# EAGLE design goodfetS10 (EAGLE 5.07)
PART_NO: ATS080B
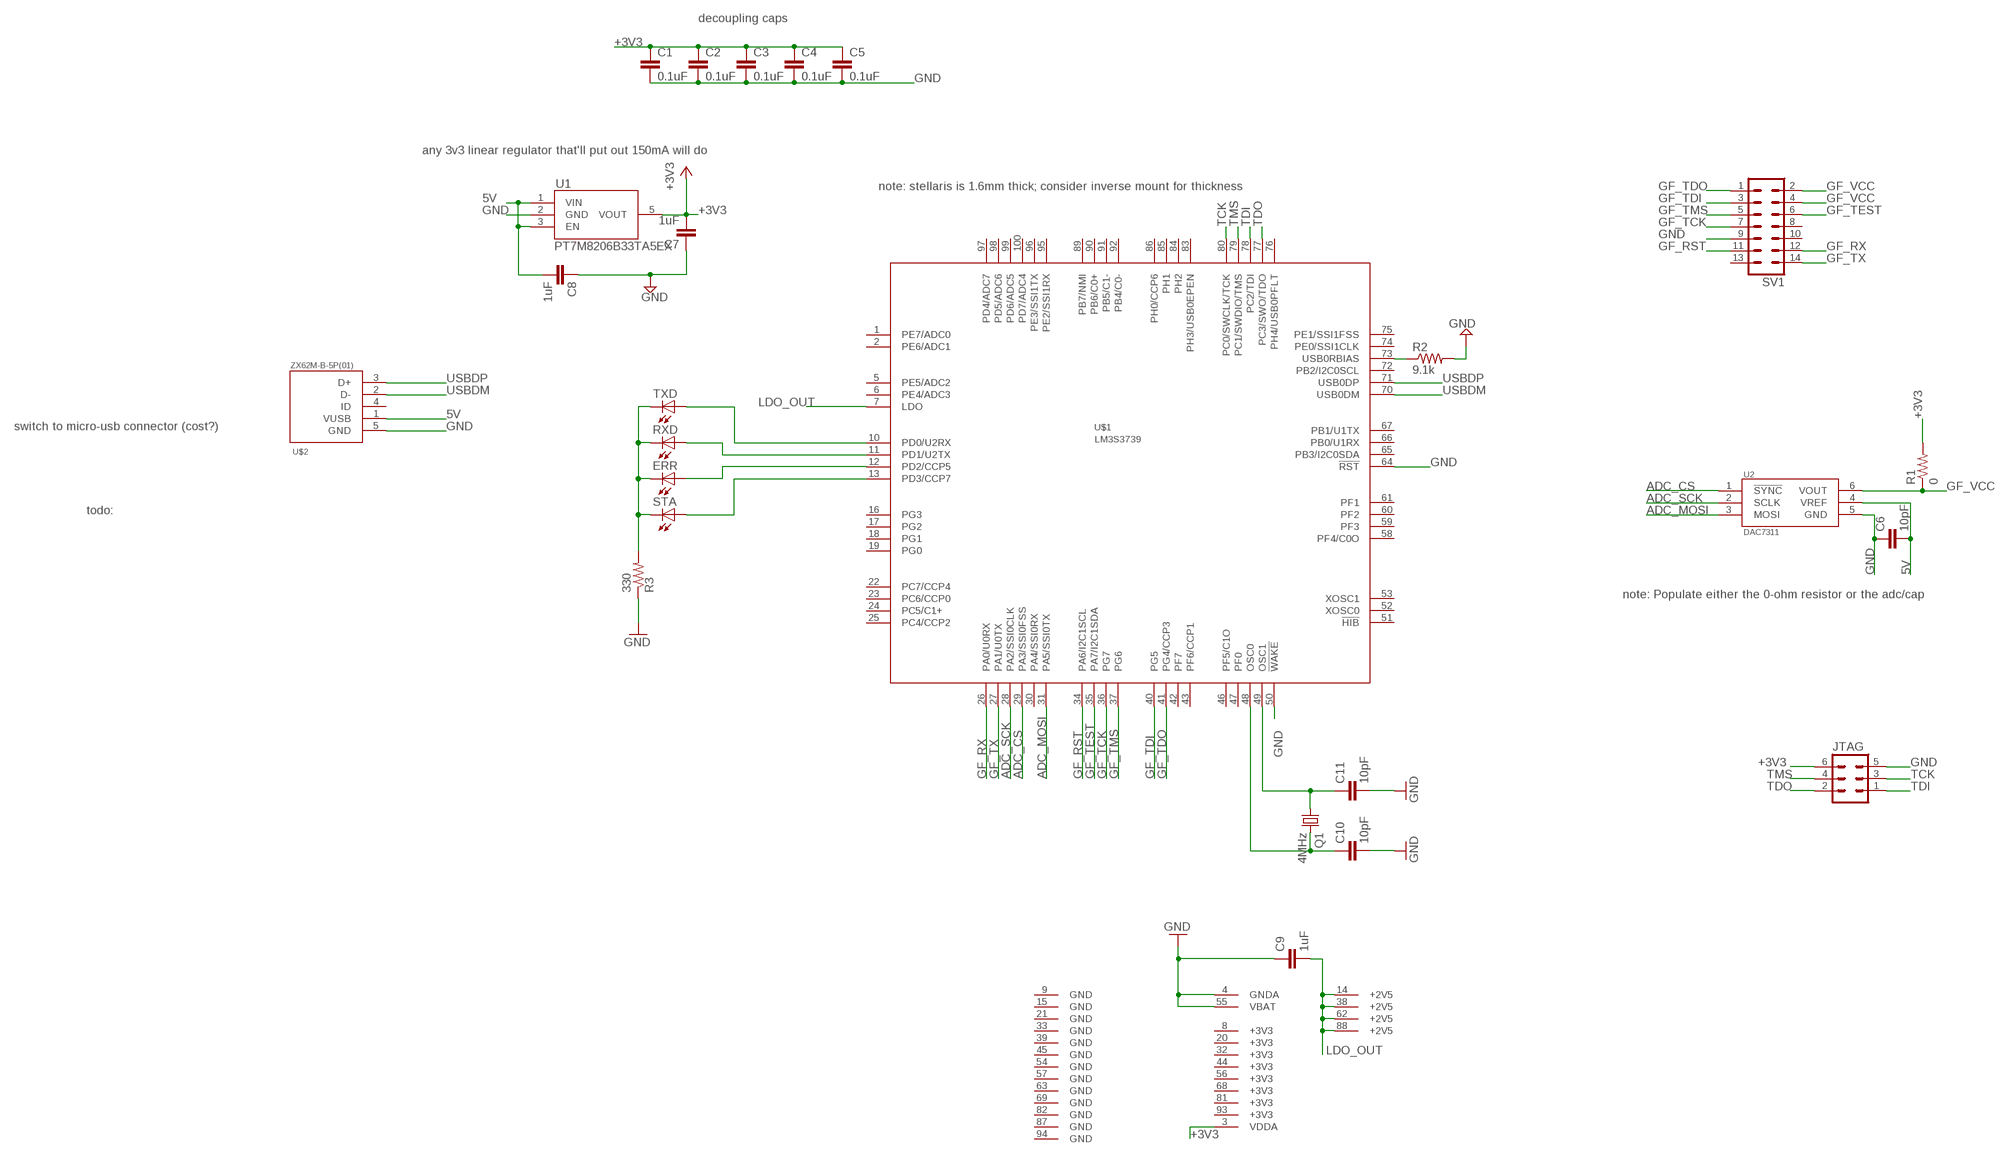
[diagram p0: schematic, sheet 1]

## Parts
C1  0.1uF  C-EUC0603  [C0603]
C2  0.1uF  C-EUC0603  [C0603]
C3  0.1uF  C-EUC0603  [C0603]
C4  0.1uF  C-EUC0603  [C0603]
C5  0.1uF  C-EUC0603  [C0603]
C6  10pF  C-EUC0603  [C0603]
C7  1uF  C-EUC0603  [C0603]
C8  1uF  C-EUC0603  [C0603]
C9  1uF  C-EUC0603  [C0603]
C10  10pF  C-EUC0603  [C0603]
C11  10pF  C-EUC0603  [C0603]
ERR  LEDCHIP-LED0603  [CHIP-LED0603]
JTAG  MA03-2  [MA03-2]
Q1  4MHz  CRYSTALHC49S  [HC49/S]
R1  0  R-US_R0603  [R0603]
R2  9.1k  R-US_R0603  [R0603]
R3  330  R-US_R0603  [R0603]
RXD  LEDCHIP-LED0603  [CHIP-LED0603]
STA  LEDCHIP-LED0603  [CHIP-LED0603]
SV1  MA07-2  [MA07-2]
TXD  LEDCHIP-LED0603  [CHIP-LED0603]
U1  PT7M8206B33TA5EX  [SOT23]
U2  DAC7311  [DCK]
U$1  LM3S3739  [QFP50P1600X1600X160-100N]
U$2  ZX62M-B-5P(01)  [ZX62M-B-5P(01)]

## Nets
5V: C6.2 C8.2 U1.1(VIN) U1.3(EN) U2.4(VREF) U$2.1(VUSB)
+3V3: C1.1 C2.1 C3.1 C4.1 C5.1 C7.2 JTAG.6 R1.2 U1.5(VOUT) U$1.3(VDDA)
ADC_CS: U2.1(!SYNC) U$1.29(PA3/SSI0FSS)
ADC_MOSI: U2.3(MOSI) U$1.31(PA5/SSI0TX)
ADC_SCK: U2.2(SCLK) U$1.28(PA2/SSI0CLK)
GF_RST: SV1.11 U$1.34(PA6/I2C1SCL)
GF_RX: SV1.12 U$1.26(PA0/U0RX)
GF_TCK: SV1.7 U$1.36(PG7)
GF_TDI: SV1.3 U$1.40(PG5)
GF_TDO: SV1.1 U$1.41(PG4/CCP3)
GF_TEST: SV1.6 U$1.35(PA7/I2C1SDA)
GF_TMS: SV1.5 U$1.37(PG6)
GF_TX: SV1.14 U$1.27(PA1/U0TX)
GF_VCC: R1.1 SV1.2 SV1.4 U2.6(VOUT)
GND: C1.2 C2.2 C3.2 C4.2 C5.2 C6.1 C7.1 C8.1 C9.1 C10.2 C11.2 JTAG.5 R2.2 R3.1 SV1.9 U1.2(GND) U2.5(GND) U$1.4(GNDA) U$1.50(!WAKE) U$1.55(VBAT) U$1.64(!RST) U$2.5(GND)
LDO_OUT: C9.2 U$1.7(LDO) U$1.14(+2V5) U$1.38(+2V5) U$1.62(+2V5) U$1.88(+2V5)
N$1: R2.1 U$1.73(USB0RBIAS)
N$2: C10.1 Q1.2 U$1.48(OSC0)
N$3: C11.1 Q1.1 U$1.49(OSC1)
N$4: ERR.C R3.2 RXD.C STA.C TXD.C
N$5: STA.A U$1.13(PD3/CCP7)
N$6: ERR.A U$1.12(PD2/CCP5)
N$7: RXD.A U$1.11(PD1/U2TX)
N$8: TXD.A U$1.10(PD0/U2RX)
TCK: JTAG.3 U$1.80(PC0/SWCLK/TCK)
TDI: JTAG.1 U$1.78(PC2/TDI)
TDO: JTAG.2 U$1.77(PC3/SWO/TDO)
TMS: JTAG.4 U$1.79(PC1/SWDIO/TMS)
USBDM: U$1.70(USB0DM) U$2.2(D-)
USBDP: U$1.71(USB0DP) U$2.3(D+)
Unconnected: SV1.8 SV1.10 SV1.13 U$1.1(PE7/ADC0) U$1.2(PE6/ADC1) U$1.5(PE5/ADC2) U$1.6(PE4/ADC3) U$1.16(PG3) U$1.17(PG2) U$1.18(PG1) U$1.19(PG0) U$1.22(PC7/CCP4) U$1.23(PC6/CCP0) U$1.24(PC5/C1+) U$1.25(PC4/CCP2) U$1.30(PA4/SSI0RX) U$1.42(PF7) U$1.43(PF6/CCP1) U$1.46(PF5/C1O) U$1.47(PF0) U$1.51(!HIB) U$1.52(XOSC0) U$1.53(XOSC1) U$1.58(PF4/C0O) U$1.59(PF3) U$1.60(PF2) U$1.61(PF1) U$1.65(PB3/I2C0SDA) U$1.66(PB0/U1RX) U$1.67(PB1/U1TX) U$1.72(PB2/I2C0SCL) U$1.74(PE0/SSI1CLK) U$1.75(PE1/SSI1FSS) U$1.76(PH4/USB0PFLT) U$1.83(PH3/USB0EPEN) U$1.84(PH2) U$1.85(PH1) U$1.86(PH0/CCP6) U$1.89(PB7/NMI) U$1.90(PB6/C0+) U$1.91(PB5/C1-) U$1.92(PB4/C0-) U$1.95(PE2/SSI1RX) U$1.96(PE3/SSI1TX) U$1.97(PD4/ADC7) U$1.98(PD5/ADC6) U$1.99(PD6/ADC5) U$1.100(PD7/ADC4) U$2.4(ID)

## Notes on the sheet
- decoupling caps
- any 3v3 linear regulator that'll put out 150mA will do
- note: stellaris is 1.6mm thick; consider inverse mount for thickness
- switch to micro-usb connector (cost?)
- todo:
- note: Populate either the 0-ohm resistor or the adc/cap

## Power pins joined to a net without a drawn wire
+3V3: U$1.8(+3V3) U$1.20(+3V3) U$1.32(+3V3) U$1.44(+3V3) U$1.56(+3V3) U$1.68(+3V3) U$1.81(+3V3) U$1.93(+3V3)
GND: U$1.9(GND) U$1.15(GND) U$1.21(GND) U$1.33(GND) U$1.39(GND) U$1.45(GND) U$1.54(GND) U$1.57(GND) U$1.63(GND) U$1.69(GND) U$1.82(GND) U$1.87(GND) U$1.94(GND)

## Library data of the parts
C1-C11 = rcl:C-EU: CAPACITOR, European symbol
ERR RXD STA TXD = led:LED: LED OSRAM: - CHIPLED LG R971, LG N971, LY N971, LG Q971, LY Q971, LO R971, LY R971 LH N974, LH R974 LS Q976, LO Q976, LY Q976 LO Q996 - Hyper CHIPLED LW Q18S LB Q993, LB Q99A, LB R99A - SideLED LS A670, LO A670, LY A670, LG A670, LP A670 LB A673, LV A673, LT A673, LW A673 LH A674 LY A675 LS A676, LA A676, LO A676, LY A676, LW A676 LS A679, LY A679, LG A679 - Hyper Micro SIDELED® LS Y876, LA Y876, LO Y876, LY Y876 LT Y87S - SmartLED LW L88C, LW L88S LB L89C, LB L89S, LG L890 LS L89K, LO L89K, LY L89K LS L896, LA L896, LO L896, LY L896 - TOPLED LS T670, LO T670, LY T670, LG T670, LP T670 LSG T670, LSP T670, LSY T670, LOP T670, LYG T670 LG T671, LOG T671, LSG T671 LB T673, LV T673, LT T673, LW T673 LH T674 LS T676, LA T676, LO T676, LY T676, LB T676, LH T676, LSB T676, LW T676 LB T67C, LV T67C, LT T67C, LS T67K, LO T67K, LY T67K, LW E67C LS E67B, LA E67B, LO E67B, LY E67B, LB E67C, LV E67C, LT E67C LW T67C LS T679, LY T679, LG T679 LS T770, LO T770, LY T770, LG T770, LP T770 LB T773, LV T773, LT T773, LW T773 LH T774 LS E675, LA E675, LY E675, LS T675 LS T776, LA T776, LO T776, LY T776, LB T776 LHGB T686 LT T68C, LB T68C - Hyper Mini TOPLED® LB M676 - Mini TOPLED Santana® LG M470 LS M47K, LO M47K, LY M47K Source: http://www.osram.convergy.de LUXEON: - LUMILED® LXK2-PW12-R00, LXK2-PW12-S00, LXK2-PW14-U00, LXK2-PW14-V00 LXK2-PM12-R00, LXK2-PM12-S00, LXK2-PM14-U00 LXK2-PE12-Q00, LXK2-PE12-R00, LXK2-PE12-S00, LXK2-PE14-T00, LXK2-PE14-U00 LXK2-PB12-K00, LXK2-PB12-L00, LXK2-PB12-M00, LXK2-PB14-N00, LXK2-PB14-P00, LXK2-PB14-Q00 LXK2-PR12-L00, LXK2-PR12-M00, LXK2-PR14-Q00, LXK2-PR14-R00 LXK2-PD12-Q00, LXK2-PD12-R00, LXK2-PD12-S00 LXK2-PH12-R00, LXK2-PH12-S00 LXK2-PL12-P00, LXK2-PL12-Q00, LXK2-PL12-R00 Source: www.luxeon.com KINGBRIGHT: KA-3528ASYC Source: www.kingbright.com
JTAG = con-lstb:MA03-2: PIN HEADER
Q1 = crystal:CRYSTAL: CRYSTAL
R1-R3 = rcl:R-US_: RESISTOR, American symbol
SV1 = random-carp:MA07-2: PIN HEADER
U1 = random-carp:PT7M8206B33TA5EX
U2 = ti-stuff:DAC7311
U$1 = stellaris:LM3S3739
U$2 = random-carp:ZX62M-B-5P(01)

## Board
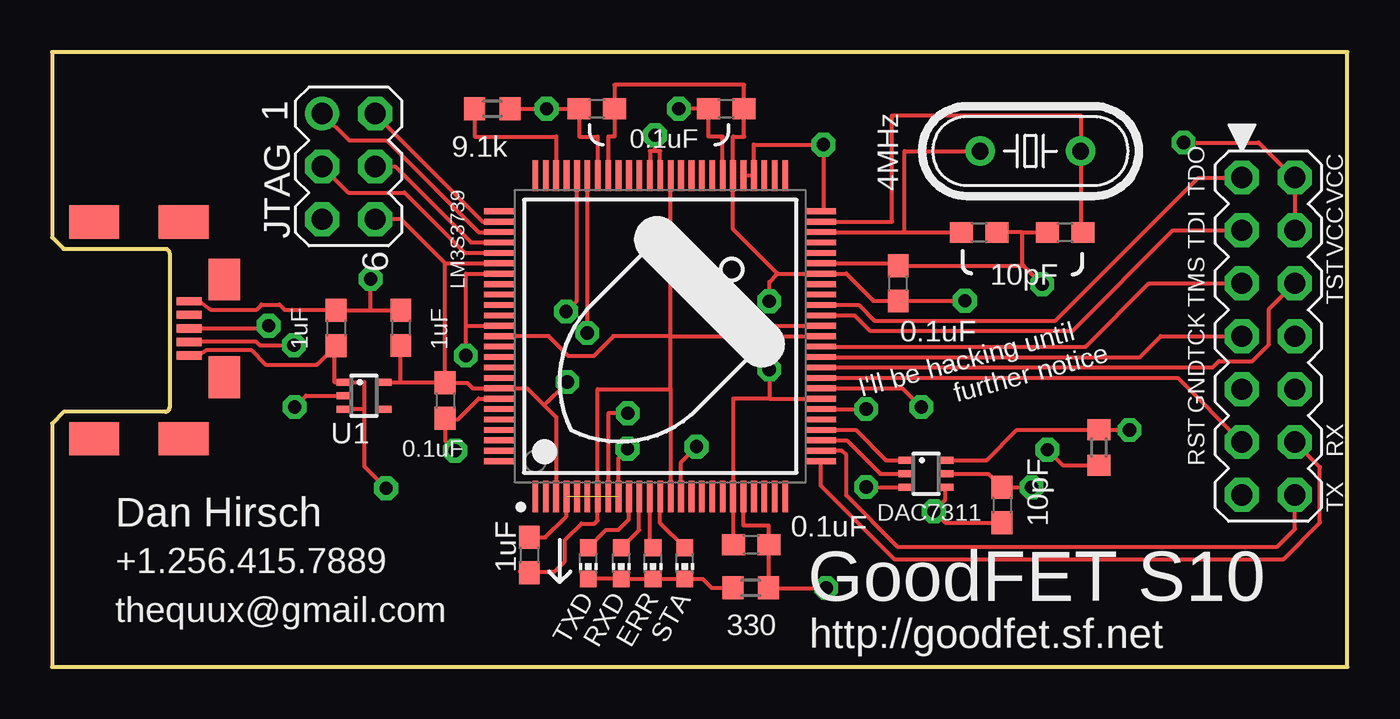
[diagram p1: board, top side]
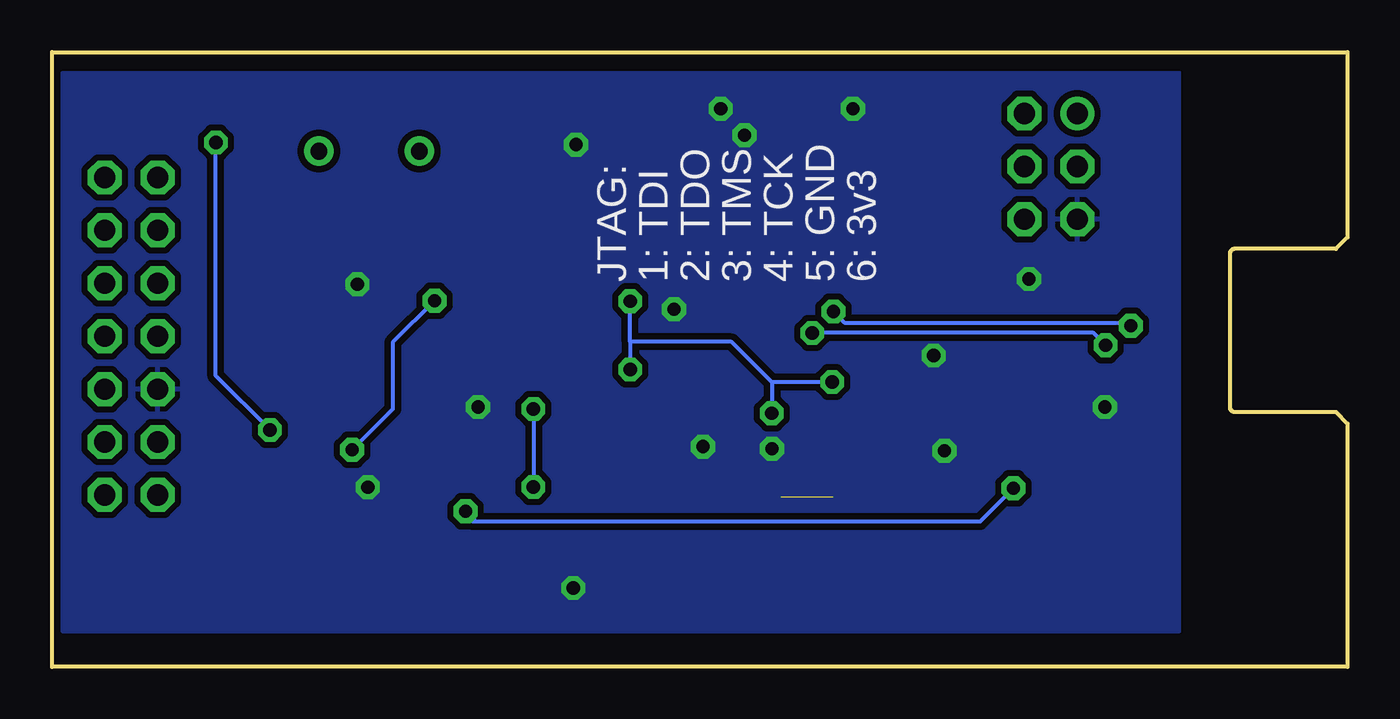
[diagram p2: board, bottom side, seen from below]

Size 62.22 x 29.52 mm. Coordinates in mm from the lower left corner, seen from the top.
Outline: 0,0 62.22,0 62.22,29.52 0,29.52 0,20.62 0.56,20.07 5.44,20.07 arc-90 5.64,19.86 5.64,12.45 arc-90 5.44,12.24 0.56,12.24 0,11.68 0,0
Copper layers (1*16): Top 0.035mm / dielectric 1.5mm / Bottom 0.035mm
Design rules "SparkFun": minimum track width 8mil, minimum drill 20mil, track to track 8mil, track to pad 8mil, pad to pad 8mil, via to via 8mil, smd to smd 8mil, copper to edge 10mil, drill to drill 8mil, minimum pad ring 12mil, minimum via ring 10mil, stop-mask expansion 4mil, vias tented up to drill 25mil, thermal gap 10mil

### Footprints (pad centres in the part's own frame; a part is rotated, then mirrored left to right if it is on the bottom)
C0603 = smd 1.1 x 1: 1 -0.85,0; 2 0.85,0
CHIP-LED0603 = smd 0.8 x 0.8: A 0,-0.75; C 0,0.75
MA03-2 = drill 1.016 round: 1 -2.54,-1.27 | drill 1.016 octagon: 2 -2.54,1.27; 3 0,-1.27; 4 0,1.27; 5 2.54,-1.27; 6 2.54,1.27
HC49/S = drill 0.813 round: 1 -2.413,0; 2 2.413,0
R0603 = smd 1 x 1.1: 1 -0.85,0; 2 0.85,0
MA07-2 = drill 1.016 octagon: 1 -7.62,-1.27; 2 -7.62,1.27; 3 -5.08,-1.27; 4 -5.08,1.27; 5 -2.54,-1.27; 6 -2.54,1.27; 7 0,-1.27; 8 0,1.27; 9 2.54,-1.27; 10 2.54,1.27; 11 5.08,-1.27; 12 5.08,1.27; 13 7.62,-1.27; 14 7.62,1.27
SOT23 = smd 0.35 x 0.8: 1 -0.65,-0.925; 2 0,-0.925; 3 0.65,-0.925; 4 0.65,0.925; 5 -0.65,0.925
DCK = smd 0.35 x 0.8: 1 -0.65,-0.925; 2 0,-0.925; 3 0.65,-0.925; 4 0.65,0.925; 5 0,0.925; 6 -0.65,0.925
QFP50P1600X1600X160-100N = smd 1.5 x 0.275: 1 -7.7,6; 2 -7.7,5.5; 3 -7.7,5; 4 -7.7,4.5; 5 -7.7,4; 6 -7.7,3.5; 7 -7.7,3; 8 -7.7,2.5; 9 -7.7,2; 10 -7.7,1.5; 11 -7.7,1; 12 -7.7,0.5; 13 -7.7,0; 14 -7.7,-0.5; 15 -7.7,-1; 16 -7.7,-1.5; 17 -7.7,-2; 18 -7.7,-2.5; 19 -7.7,-3; 20 -7.7,-3.5; 21 -7.7,-4; 22 -7.7,-4.5; 23 -7.7,-5; 24 -7.7,-5.5; 25 -7.7,-6; 51 7.7,-6; 52 7.7,-5.5; 53 7.7,-5; 54 7.7,-4.5; 55 7.7,-4; 56 7.7,-3.5; 57 7.7,-3; 58 7.7,-2.5; 59 7.7,-2; 60 7.7,-1.5; 61 7.7,-1; 62 7.7,-0.5; 63 7.7,0; 64 7.7,0.5; 65 7.7,1; 66 7.7,1.5; 67 7.7,2; 68 7.7,2.5; 69 7.7,3; 70 7.7,3.5; 71 7.7,4; 72 7.7,4.5; 73 7.7,5; 74 7.7,5.5; 75 7.7,6 | smd 0.275 x 1.5: 26 -6,-7.7; 27 -5.5,-7.7; 28 -5,-7.7; 29 -4.5,-7.7; 30 -4,-7.7; 31 -3.5,-7.7; 32 -3,-7.7; 33 -2.5,-7.7; 34 -2,-7.7; 35 -1.5,-7.7; 36 -1,-7.7; 37 -0.5,-7.7; 38 0,-7.7; 39 0.5,-7.7; 40 1,-7.7; 41 1.5,-7.7; 42 2,-7.7; 43 2.5,-7.7; 44 3,-7.7; 45 3.5,-7.7; 46 4,-7.7; 47 4.5,-7.7; 48 5,-7.7; 49 5.5,-7.7; 50 6,-7.7; 76 6,7.7; 77 5.5,7.7; 78 5,7.7; 79 4.5,7.7; 80 4,7.7; 81 3.5,7.7; 82 3,7.7; 83 2.5,7.7; 84 2,7.7; 85 1.5,7.7; 86 1,7.7; 87 0.5,7.7; 88 0,7.7; 89 -0.5,7.7; 90 -1,7.7; 91 -1.5,7.7; 92 -2,7.7; 93 -2.5,7.7; 94 -3,7.7; 95 -3.5,7.7; 96 -4,7.7; 97 -4.5,7.7; 98 -5,7.7; 99 -5.5,7.7; 100 -6,7.7
ZX62M-B-5P(01) = smd 0.4 x 1.2: 1 1.3,0; 2 0.65,0; 3 0,0; 4 -0.65,0; 5 -1.3,0 | smd 1.6 x 2.4: MI1 -5.1,-4.55; MI2 -5.1,-0.25; MI5 5.3,-0.25; MI6 5.3,-4.55 | smd 2 x 1.5: MI3 -2.35,1.7; MI4 2.35,1.7

### Placement (x,y rotation side)
C1  26.16,26.8 180 top
C2  32.38,26.8 180 top
C3  18.88,12.78 270 top
C4  33.58,5.87 0 top
C5  40.64,18.41 90 top
C6  45.62,7.78 270 top
C7  16.75,16.28 270 top
C8  13.64,16.27 270 top
C9  22.92,5.37 270 top
C10  44.53,20.86 0 top
C11  48.65,20.86 180 top
ERR  28.87,4.97 180 top
JTAG  14.25,24.02 270 top
Q1  46.99,24.77 180 top
R1  50.28,10.54 270 top
R2  21.15,26.8 0 top
R3  33.56,3.79 180 top
RXD  27.34,4.97 180 top
STA  30.39,4.97 180 top
SV1  58.42,15.88 270 top
TXD  25.76,4.97 180 top
U1  14.99,13.02 270 top
U2  41.97,9.27 270 top
U$1  29.21,15.88 90 top
U$2  6.58,16.25 270 top

### Tracks (layer width: path | path; a pad name or v marks a point on that pad's centre or on a via)
5V  (via drill 0.64 pad 0.61)
  Top 0.203: 14.06,12.38 U1.3 14.98,12.37 15,12.35 | U2.4 42.9,8.02 v42.35,7.47 42.9,6.92 C6.2 | 15,12.35 15,13.67 U1.1 13.55,13.67 13.55,15.43 C8.2 12.73,14.52 10.27,14.52 9.56,15.22 7.45,15.22 7.12,15 7.07,14.95 U$2.1 | 15,12.35 15,9.62 v16.05,8.57
  Bottom 0.203: v16.05,8.57 17.65,6.97 42,6.97 42,7.12 | 42,7.12 41.85,6.97 | 42,7.12 v42.35,7.47
+3V3  (via drill 0.64 pad 0.61)
  Top 0.203: U$1.68 26.71,25.46 27.01,25.46 C1.1 27.01,27.94 33.23,27.94 C2.1 33.23,25.46 32.71,25.46 U$1.56 32.71,21.02 34.85,18.88 | 34.45,12.88 32.71,12.88 U$1.20 32.71,5.87 C4.1 | 34.45,12.88 U$1.32 | U$1.3 24.21,11.98 23.64,12.56 | 23.64,12.56 22.82,13.38 U$1.93 20.2,13.38 19.95,13.63 C3.1 | C3.1 18.88,19.38 | 18.88,19.38 U$1.81 | 34.85,18.88 U$1.44 38.15,18.88 39.45,17.57 40.63,17.57 C5.1 40.65,17.57 v43.85,17.57 | v34.45,14.28 34.45,12.88 | 23.64,12.56 v24.75,13.68 | v27.65,12.18 26.71,12.18 U$1.8 | 16.75,13.67 C7.2 | U1.5 16.75,13.67 | 18.88,19.38 16.77,21.48 JTAG.6 | R1.2 48.54,9.69 v47.8,10.42 | 34.85,18.88 34.45,18.48 v34.45,17.55 | 16.75,13.67 18.85,13.67 C3.1
  Bottom 0.203: 34.45,15.6 v34.45,14.28 | v43.85,17.57 45.85,15.57 45.85,12.38 v47.8,10.42 | v24.75,13.68 27.65,13.68 | 27.65,13.68 v27.65,12.18 | 27.65,13.68 29.57,15.6 34.45,15.6 | 34.45,15.6 v34.45,17.55
ADC_CS
  Top 0.203: U2.1 40.05,9.92 38.6,11.38 U$1.29
ADC_MOSI  (via drill 0.64 pad 0.61)
  Top 0.203: U$1.31 v39.1,12.38 | U2.3 39.1,8.62 v39.1,8.64
  Bottom 0.203: v39.1,12.38 v39.1,8.64
ADC_SCK
  Top 0.203: U$1.28 38.18,10.88 39.78,9.27 U2.2
GF_RST
  Top 0.203: U$1.34 54.07,13.88 SV1.11
GF_RX
  Top 0.203: U$1.26 36.91,8.71 40.45,5.17 59.15,5.17 60.9,6.92 60.9,9.59 SV1.12
GF_TCK
  Top 0.203: U$1.36 52.25,14.88 53.25,15.88 SV1.7
GF_TDI
  Top 0.203: U$1.40 38.55,16.88 39.28,16.14 49.02,16.14 49.02,16.15 53.83,20.95 SV1.3
GF_TDO
  Top 0.203: U$1.41 38.75,17.38 39.5,16.62 48.2,16.62 55.05,23.48 57.13,23.48 SV1.1
GF_TEST
  Top 0.203: U$1.35 55.75,14.38 56.05,14.68 57.65,14.68 58.45,15.47 58.45,17.18 SV1.6
GF_TMS
  Top 0.203: U$1.37 49.65,15.38 52.69,18.41 SV1.5
GF_TX
  Top 0.203: U$1.27 37.95,10.38 38.15,10.18 38.15,8.23 40.6,5.78 58.85,5.78 59.69,6.62 SV1.14
GF_VCC  (via drill 0.64 pad 0.61)
  Top 0.203: U2.6 44.9,9.92 46.35,11.38 50.27,11.38 R1.1 51.74,11.39 v51.75,11.38 | v54.35,25.18 57.95,25.18 59.63,23.5 SV1.2 SV1.4
  Bottom 0.203: v51.75,11.38 54.35,13.97 v54.35,25.18
GND  (via drill 0.64 pad 0.61)  (1 unrouted)
  Top 0.203: U$1.57 32.21,25.46 31.54,25.46 C2.2 v30.1,26.8 | U$1.69 26.21,25.46 25.31,25.46 C1.2 v23.75,26.8 R2.2 | U$1.21 33.21,6.78 34.43,6.78 C4.2 34.43,3.81 R3.1 | 28.96,24.77 v28.96,25.53 | U$1.63 29.21,24.77 28.96,24.77 | U$1.64 28.71,24.77 28.96,24.77 | U$1.55 U$1.54 33.71,25.07 v37.05,25.07 37.05,21.88 U$1.50 | U$1.82 19.88,18.88 19.88,16.38 | 19.88,16.38 U$1.87 | v19.88,14.95 19.88,16.38 | U1.2 12.19,13.02 v11.65,12.47 | C3.2 18.88,11.88 | 18.88,11.88 18.88,10.85 v19.35,10.38 | U2.5 44.97,9.27 C6.1 v47.05,8.62 | U$1.45 40.53,19.38 C5.2 46.61,19.27 | 46.61,20.86 C10.2 | 46.61,20.86 C11.2 | 46.61,19.27 46.61,20.86 | U$1.15 30.21,9.84 v30.95,10.57 | U$1.9 27.21,10.04 v27.64,10.47 | U$1.39 33.15,16.38 v32.35,17.18 | 46.61,19.27 46.66,19.27 v47.55,18.38 | U$1.33 40.85,13.38 v41.75,12.47 | 15.3,17.12 C7.1 | 15.3,17.12 v15.3,18.62 | 15.3,17.12 C8.1 13.62,17.14 11.17,17.14 10.92,17.39 10.06,17.39 9.83,17.16 7.61,17.16 7.09,17.55 U$2.5 | U$1.4 24.71,7.24 23.69,6.21 C9.1 | R3.1 v37.19,3.78 | R3.1 34.38,3.78 | 18.88,11.88 19.5,11.88 20.5,12.88 U$1.94
  pour Bottom (isolate 0.305): 8.06,28.51 61.72,28.51 61.72,1.71 8.06,1.71
LDO_OUT
  Top 0.203: 29.71,15.88 U$1.62 | 29.71,15.88 U$1.38 | 29.71,13.34 29.71,15.88 | 29.71,13.34 U$1.14 | 29.71,15.88 26.96,15.88 26.01,14.93 24.8,14.93 23.85,15.88 U$1.88 | 29.71,13.34 26.21,13.34 U$1.7 26.21,7.04 26.05,6.88 25.42,6.88 24.64,6.1 24.64,5.08 24.13,4.57 22.47,4.57 C9.2
N$1
  Top 0.203: R2.1 20.3,25.46 24.21,25.46 U$1.73
N$2
  Top 0.203: Q1.2 40.95,24.77 40.95,20.88 | U$1.48 40.95,20.88 | 40.95,20.88 43.68,20.88 C10.1
N$3
  Top 0.203: U$1.49 40.35,21.38 40.35,26.48 49.4,26.48 Q1.1 49.4,20.95 C11.1
N$4
  Top 0.203: TXD.C RXD.C ERR.C STA.C 31.25,4.22 31.68,3.79 R3.2
N$5
  Top 0.203: U$1.13 29.21,6.9 STA.A
N$6
  Top 0.203: U$1.12 28.71,5.88 ERR.A
N$7
  Top 0.203: U$1.11 28.19,8.18 28.19,6.57 RXD.A
N$8
  Top 0.203: U$1.10 27.71,7.08 27.2,6.58 26.61,6.58 TXD.A
TCK
  Top 0.203: U$1.80 19.82,19.88 16.93,22.77 14.23,22.77 JTAG.3
TDI
  Top 0.203: U$1.78 20.48,20.88 16.07,25.27 14.27,25.27 JTAG.1
TDO
  Top 0.203: U$1.77 20.67,21.38 15.52,26.53 JTAG.2
TMS
  Top 0.203: U$1.79 20.12,20.38 16.48,24.02 JTAG.4
USBDM  (via drill 0.64 pad 0.61)
  Top 0.203: v25.71,16.03 U$1.70 | v11.61,15.44 9.98,15.44 9.79,15.63 6.6,15.63 U$2.2
  Bottom 0.203: v11.61,15.44 12.2,16.03 v25.71,16.03
USBDP  (via drill 0.64 pad 0.61)
  Top 0.203: U$1.71 25.21,17.59 v24.69,17.06 | U$2.3 10.28,16.25 v10.4,16.38
  Bottom 0.203: v24.69,17.06 24.12,16.5 10.53,16.5 v10.4,16.38

### Text on the board
tPlace: VCC | TDO | VCC | TDI | TST | TMS | TCK | I'll be hacking until | further notice | GND | RX | RST | TX | Dan Hirsch | +1.256.415.7889 | GoodFET S10 | thequux@gmail.com | http://goodfet.sf.net
bPlace: 6: 3v3 | 5: GND | 4: TCK | 3: TMS | 2: TDO | 1: TDI | JTAG: